# EAGLE schematic 605_motor (EAGLE 8.2.2)
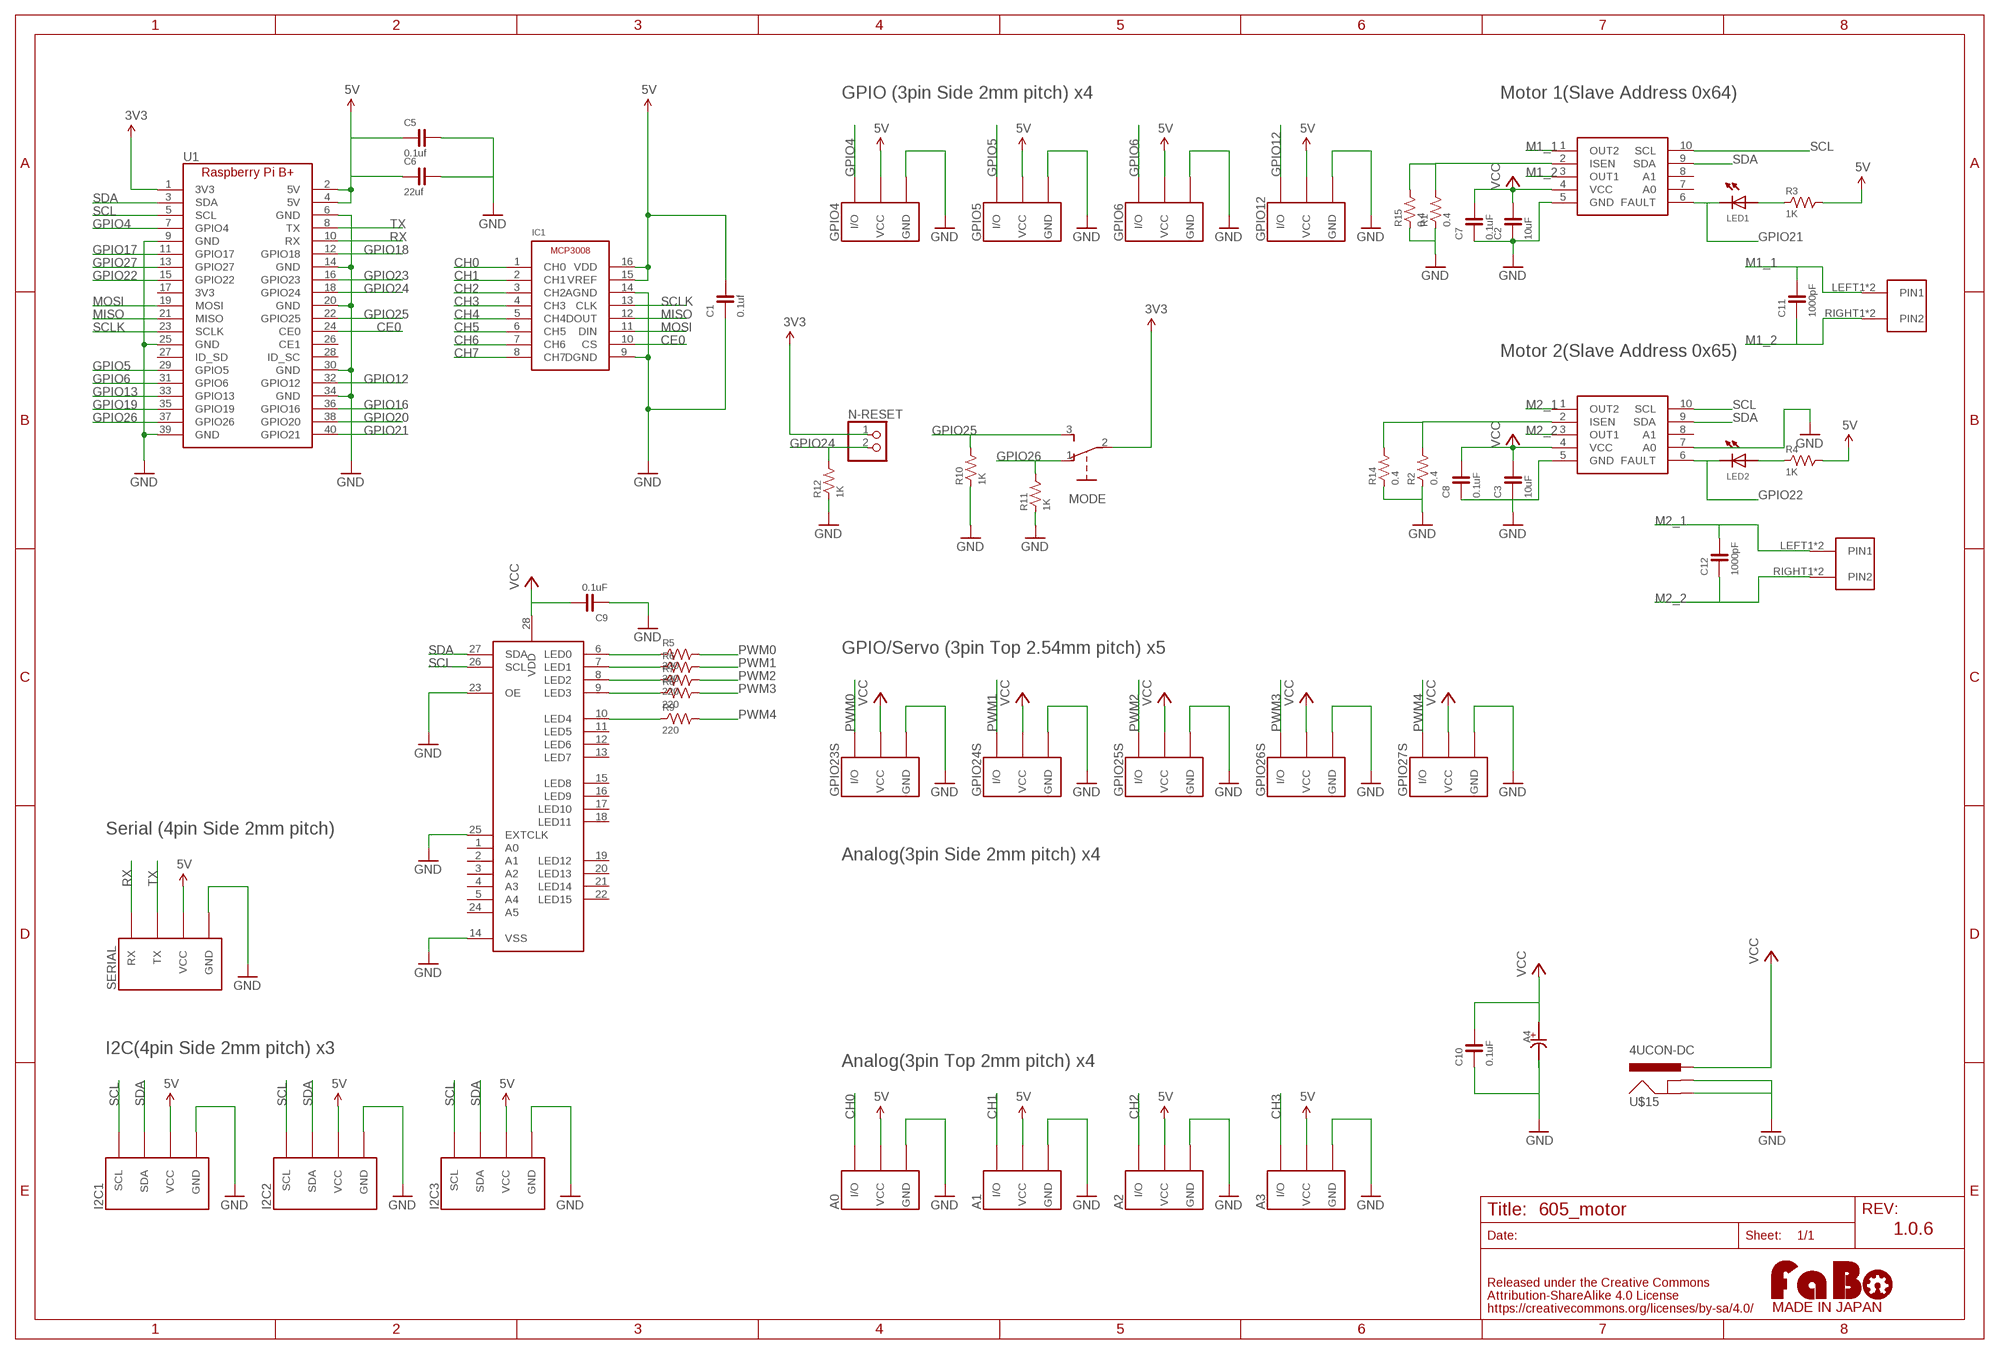
[diagram p0: schematic, sheet 1]

## Parts
A0  FABO_BRICK_3PIN-B03B-PASK-1  [FABO_BRICK_3PIN_B03B-PASK-1]
A1  FABO_BRICK_3PIN-B03B-PASK-1  [FABO_BRICK_3PIN_B03B-PASK-1]
A2  FABO_BRICK_3PIN-B03B-PASK-1  [FABO_BRICK_3PIN_B03B-PASK-1]
A3  FABO_BRICK_3PIN-B03B-PASK-1  [FABO_BRICK_3PIN_B03B-PASK-1]
A4  CAPACITOR-ALUMIN  [H13]
C1  0.1uf  CAPACITOR-0603  [0603]
C2  10uF  CAPACITOR-0603  [0603]
C3  10uF  CAPACITOR-0603  [0603]
C5  0.1uf  CAPACITOR-0603  [0603]
C6  22uf  CAPACITOR-0603  [0603]
C7  0.1uF  CAPACITOR-0603  [0603]
C8  0.1uF  CAPACITOR-0603  [0603]
C9  0.1uF  CAPACITOR-0603  [0603]
C10  0.1uF  CAPACITOR-0603  [0603]
C11  1000pF  CAPACITOR-0603  [0603]
C12  1000pF  CAPACITOR-0603  [0603]
GPIO4  FABO_BRICK_3PIN-S03B-PASK-2  [FABO_BRICK_3PIN_S03B-PASK-2]
GPIO5  FABO_BRICK_3PIN-S03B-PASK-2  [FABO_BRICK_3PIN_S03B-PASK-2]
GPIO6  FABO_BRICK_3PIN-S03B-PASK-2  [FABO_BRICK_3PIN_S03B-PASK-2]
GPIO12  FABO_BRICK_3PIN-S03B-PASK-2  [FABO_BRICK_3PIN_S03B-PASK-2]
GPIO23S  FABO_BRICK_3PIN-HEADER  [FABO_BRICK_3PIN_HEADER]
GPIO24S  FABO_BRICK_3PIN-HEADER  [FABO_BRICK_3PIN_HEADER]
GPIO25S  FABO_BRICK_3PIN-HEADER  [FABO_BRICK_3PIN_HEADER]
GPIO26S  FABO_BRICK_3PIN-HEADER  [FABO_BRICK_3PIN_HEADER]
GPIO27S  FABO_BRICK_3PIN-HEADER  [FABO_BRICK_3PIN_HEADER]
I2C1  FABO_BRICK_I2C-S04B-PASK-2  [FABO_BRICK_I2C_S04B-PASK-2]
I2C2  FABO_BRICK_I2C-S04B-PASK-2  [FABO_BRICK_I2C_S04B-PASK-2]
I2C3  FABO_BRICK_I2C-S04B-PASK-2  [FABO_BRICK_I2C_S04B-PASK-2]
IC1  MICROCHIP-MCP3008  [MICROCHIP-MCP3008]
LED1  LED-0603  [0603]
LED2  LED-0603  [0603]
MODE  SLIDE-EG1218  [EG1218]
N-RESET  PINHD-1X2  [1X02]
R1  0.4  RESISTOR-0603  [0603]
R2  0.4  RESISTOR-0603  [0603]
R3  1K  RESISTOR-0603  [0603]
R4  1K  RESISTOR-0603  [0603]
R5  220  RESISTOR-0603  [0603]
R6  220  RESISTOR-0603  [0603]
R7  220  RESISTOR-0603  [0603]
R8  220  RESISTOR-0603  [0603]
R9  220  RESISTOR-0603  [0603]
R10  1K  RESISTOR-0603  [0603]
R11  1K  RESISTOR-0603  [0603]
R12  1K  RESISTOR-0603  [0603]
R14  0.4  RESISTOR-0603  [0603]
R15  0.4  RESISTOR-0603  [0603]
SERIAL  FABO_BRICK_SERIAL-S04B-PASK-2  [FABO_BRICK_SERIAL_S04B-PASK-2]
U1  RASPBERRY_PI_B+  [RASPBERRY_PI_B+]
U$8  DRV8830  [DRV8830]
U$9  PCA9685  [PCA9685]
U$10  DRV8830  [DRV8830]
U$12  ML-1400-S1  [ML-1400-S1]
U$13  ML-1400-S1  [ML-1400-S1]
U$14  LOGO_FABO-M  [LOGO_FABO_MS]
U$15  4UCON-DC  [4UCON-DC]

## Nets
3V3: MODE.2 N-RESET.1 U1.1(3V3)
5V: A0.VCC A1.VCC A2.VCC A3.VCC C1.2 C5.1 C6.1 GPIO4.VCC GPIO5.VCC GPIO6.VCC GPIO12.VCC I2C1.VCC I2C2.VCC I2C3.VCC IC1.15(VREF) IC1.16(VDD) R3.2 R4.2 SERIAL.VCC U1.2(5V) U1.4(5V)
CE0: IC1.10(CS) U1.24(CE0)
CH0: A0.I/O IC1.1(CH0)
CH1: A1.I/O IC1.2(CH1)
CH2: A2.I/O IC1.3(CH2)
CH3: A3.I/O IC1.4(CH3)
CH4: IC1.5(CH4)
CH5: IC1.6(CH5)
CH6: IC1.7(CH6)
CH7: IC1.8(CH7)
GND: A0.GND A1.GND A2.GND A3.GND A4.MINUS(-) C1.1 C2.1 C3.1 C5.2 C6.2 C7.1 C8.1 C9.1 C10.1 GPIO4.GND GPIO5.GND GPIO6.GND GPIO12.GND GPIO23S.GND GPIO24S.GND GPIO25S.GND GPIO26S.GND GPIO27S.GND I2C1.GND I2C2.GND I2C3.GND IC1.9(DGND) IC1.14(AGND) R1.1 R2.1 R10.1 R11.1 R12.1 R14.1 R15.1 SERIAL.GND U1.6(GND) U1.9(GND) U1.14(GND) U1.20(GND) U1.25(GND) U1.30(GND) U1.34(GND) U1.39(GND) U$8.5(GND) U$9.14(VSS) U$9.23(OE) U$9.25(EXTCLK) U$10.5(GND) U$10.7(A0) U$15.GND1(GND) U$15.GND2(GNDBREAK)
GPIO4: GPIO4.I/O U1.7(GPIO4)
GPIO5: GPIO5.I/O U1.29(GPIO5)
GPIO6: GPIO6.I/O U1.31(GPIO6)
GPIO12: GPIO12.I/O U1.32(GPIO12)
GPIO13: U1.33(GPIO13)
GPIO16: U1.36(GPIO16)
GPIO17: U1.11(GPIO17)
GPIO18: U1.12(GPIO18)
GPIO19: U1.35(GPIO19)
GPIO20: U1.38(GPIO20)
GPIO21: LED1.CATHODE U1.40(GPIO21) U$8.6(FAULT)
GPIO22: LED2.CATHODE U1.15(GPIO22) U$10.6(FAULT)
GPIO23: U1.16(GPIO23)
GPIO24: N-RESET.2 R12.2 U1.18(GPIO24)
GPIO25: MODE.3 R10.2 U1.22(GPIO25)
GPIO26: MODE.1 R11.2 U1.37(GPIO26)
GPIO27: U1.13(GPIO27)
LED0: R5.1 U$9.6(LED0)
LED1: R6.1 U$9.7(LED1)
LED2: R7.1 U$9.8(LED2)
LED3: R8.1 U$9.9(LED3)
LED4: R9.1 U$9.10(LED4)
M1_1: C11.2 U$8.1(OUT2) U$12.LEFT1(PIN1) U$12.LEFT2(PIN1)
M1_2: C11.1 U$8.3(OUT1) U$12.RIGHT1(PIN2) U$12.RIGHT2(PIN2)
M2_1: C12.2 U$10.1(OUT2) U$13.LEFT1(PIN1) U$13.LEFT2(PIN1)
M2_2: C12.1 U$10.3(OUT1) U$13.RIGHT1(PIN2) U$13.RIGHT2(PIN2)
MISO: IC1.12(DOUT) U1.21(MISO)
MOSI: IC1.11(DIN) U1.19(MOSI)
N$2: R1.2 R15.2 U$8.2(ISEN)
N$3: R2.2 R14.2 U$10.2(ISEN)
N$4: LED1.ANODE R3.1
N$6: LED2.ANODE R4.1
PWM0: GPIO23S.I/O R5.2
PWM1: GPIO24S.I/O R6.2
PWM2: GPIO25S.I/O R7.2
PWM3: GPIO26S.I/O R8.2
PWM4: GPIO27S.I/O R9.2
RX: SERIAL.RX U1.10(RX)
SCL: I2C1.SCL I2C2.SCL I2C3.SCL U1.5(SCL) U$8.10(SCL) U$9.26(SCL) U$10.10(SCL)
SCLK: IC1.13(CLK) U1.23(SCLK)
SDA: I2C1.SDA I2C2.SDA I2C3.SDA U1.3(SDA) U$8.9(SDA) U$9.27(SDA) U$10.9(SDA)
TX: SERIAL.TX U1.8(TX)
VCC: A4.PLUS(+) C2.2 C3.2 C7.2 C8.2 C9.2 C10.2 GPIO23S.VCC GPIO24S.VCC GPIO25S.VCC GPIO26S.VCC GPIO27S.VCC U$8.4(VCC) U$9.28(VDD) U$10.4(VCC) U$15.VCC(PWR)
Unconnected: U1.17(3V3) U1.26(CE1) U1.27(ID_SD) U1.28(ID_SC) U$8.7(A0) U$8.8(A1) U$9.1(A0) U$9.2(A1) U$9.3(A2) U$9.4(A3) U$9.5(A4) U$9.11(LED5) U$9.12(LED6) U$9.13(LED7) U$9.15(LED8) U$9.16(LED9) U$9.17(LED10) U$9.18(LED11) U$9.19(LED12) U$9.20(LED13) U$9.21(LED14) U$9.22(LED15) U$9.24(A5) U$10.8(A1)

## Notes on the sheet
- GPIO (3pin Side 2mm pitch) x4 | Motor 1(Slave Address 0x64)
- Motor 2(Slave Address 0x65)
- GPIO/Servo (3pin Top 2.54mm pitch) x5
- Serial (4pin Side 2mm pitch)
- Analog(3pin Side 2mm pitch) x4
- I2C(4pin Side 2mm pitch) x3
- Analog(3pin Top 2mm pitch) x4
- 1.0.6

## Library data of the parts
A0 A1-A3 GPIO4-GPIO6 GPIO12 GPIO23S GPIO24S GPIO25S GPIO26S GPIO27S = FaBo-Template:FABO_BRICK_3PIN: FaBo Brick 3pin
A4 = FaBo-Capacitor:CAPACITOR-ALUMIN
C1-C3 C5-C12 = FaBo-Capacitor:CAPACITOR: CAPACITOR
I2C1-I2C3 = FaBo-Template:FABO_BRICK_I2C: FaBo Brick I2C
IC1 = FaBo-ADC:MICROCHIP-MCP3008
LED1 LED2 = FaBo-LED:LED
MODE = FaBo-Switch:SLIDE
N-RESET = pinhead:PINHD-1X2: PIN HEADER
R1-R12 R14 R15 = FaBo-Resistors:RESISTOR: RESISTOR
SERIAL = FaBo-Template:FABO_BRICK_SERIAL: FaBo Brick Serial
U1 = FaBo-Boards:RASPBERRY_PI_B+
U$8 U$10 = FaBo-Motor:DRV8830
U$9 = FaBo-Motor:PCA9685
U$12 U$13 = FaBo-Terminal:ML-1400-S1
U$14 = FaBo-etc:LOGO_FABO
U$15 = FaBo-Supply:4UCON-DC